# Altium schematic sheet heaters.SchDoc
size A4
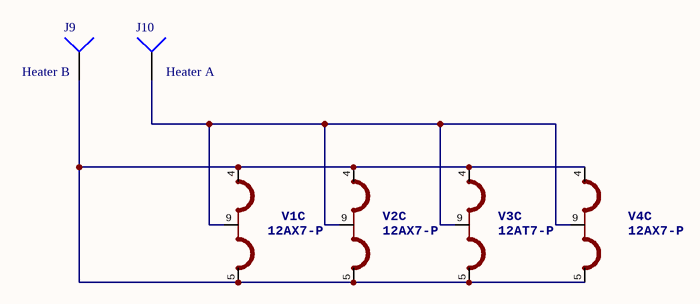
[diagram p0: heaters.SchDoc]

## Parts
J9  Heater B  [PIN1]
J10  Heater A  [PIN1]
V1  12AX7-P  [NOVAL]  (part C of 3)
V2  12AX7-P  [NOVAL]  (part C of 3)
V3  12AT7-P  [NOVAL]  (part C of 3)
V4  12AX7-P  [NOVAL]  (part C of 3)

## Nets
NetJ9_1: J9.1 V1.4(H1) V1.5(H3) V2.4(H1) V2.5(H3) V3.4(H1) V3.5(H3) V4.4(H1) V4.5(H3)
NetJ10_1: J10.1 V1.9(H2) V2.9(H2) V3.9(H2) V4.9(H2)

## Library data of the parts
J9 J10 = Socket: LatestRevisionDate: 17-Jul-2002; LatestRevisionNote: Re-released for DXP Platform.; Publisher: Altium Limited